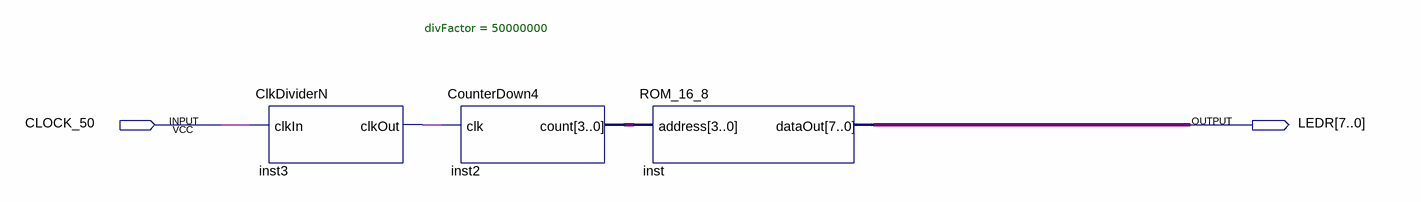
[diagram p0: schematic sheet]
// Quartus schematic ROM_Demo.bdf as structural Verilog: 3 symbols, 2 pins
module ROM_Demo (
  input  CLOCK_50,
  output [7:0] LEDR
);

  wire inst3_clkout;
  wire [3:0] inst2_count;

  ClkDividerN #(.divFactor(50000000)) inst3 (.clkIn(CLOCK_50), .clkOut(inst3_clkout));
  CounterDown4 inst2 (.clk(inst3_clkout), .count(inst2_count));
  ROM_16_8 inst (.address(inst2_count), .dataOut(LEDR));
endmodule
